# EAGLE design kinks (EAGLE 8.5.2)

## Sheet 1 of 4
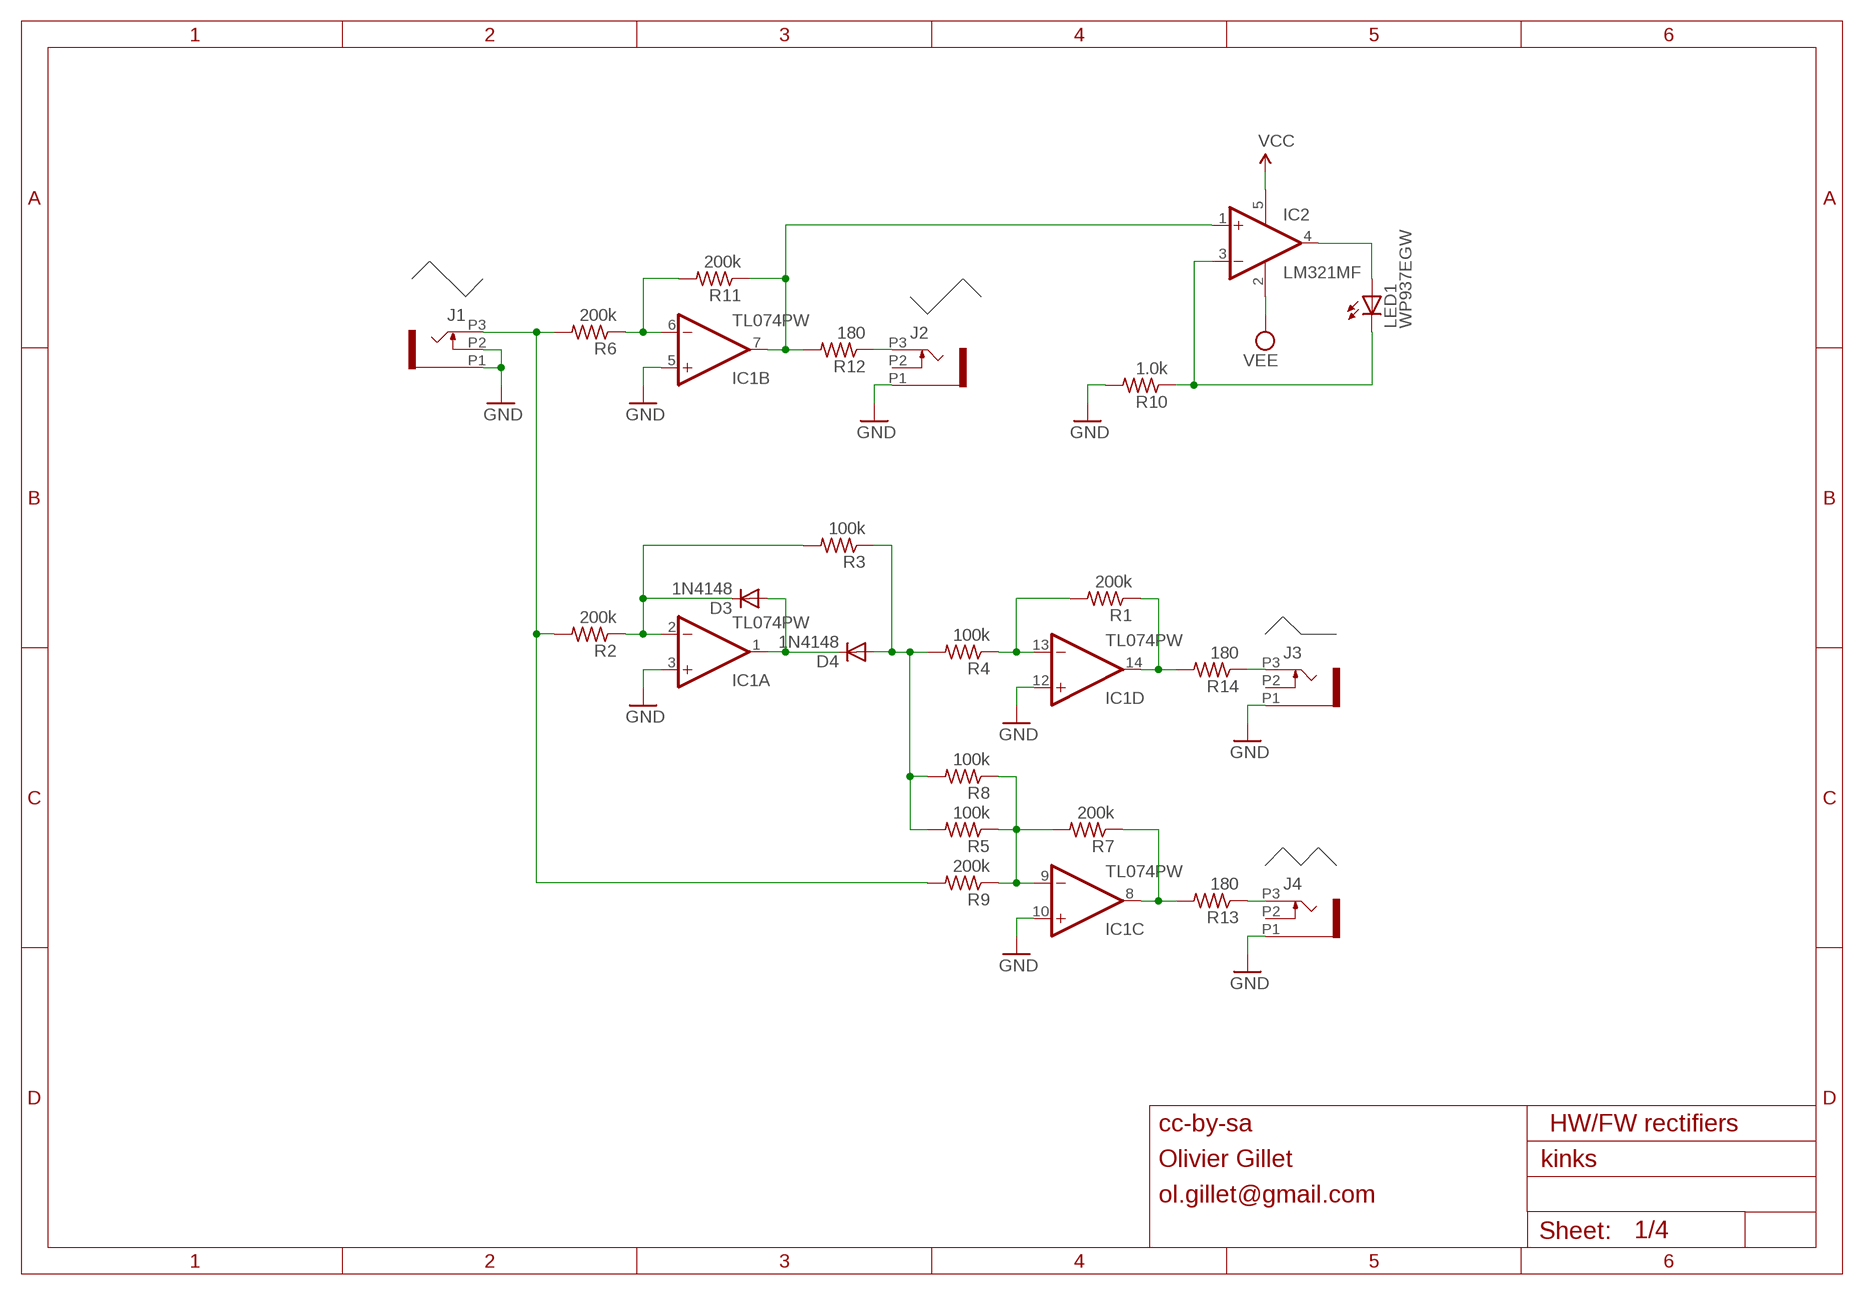
[diagram p0: schematic, sheet 1]

### Parts
D3  1N4148  DIODE-SOD523  [SOD523]
D4  1N4148  DIODE-SOD523  [SOD523]
IC1  TL074PW  [TSSOP14]
IC2  LM321MF  [SOT23-5]
J1  PJ301_THONKICONN6  [WQP_PJ_301M6]
J2  PJ301_THONKICONN6  [WQP_PJ_301M6]
J3  PJ301_THONKICONN6  [WQP_PJ_301M6]
J4  PJ301_THONKICONN6  [WQP_PJ_301M6]
LED1  WP937EGW  LED3MM  [LED3MM]
R1  200k  R-US_R0402  [R0402]
R2  200k  R-US_R0402  [R0402]
R3  100k  R-US_R0402  [R0402]
R4  100k  R-US_R0402  [R0402]
R5  100k  R-US_R0402  [R0402]
R6  200k  R-US_R0402  [R0402]
R7  200k  R-US_R0402  [R0402]
R8  100k  R-US_R0402  [R0402]
R9  200k  R-US_R0402  [R0402]
R10  1.0k  R-US_R0402  [R0402]
R11  200k  R-US_R0402  [R0402]
R12  180  R-US_R0402  [R0402]
R13  180  R-US_R0402  [R0402]
R14  180  R-US_R0402  [R0402]

### Nets
GND: IC1.3(A:+IN) IC1.5(B:+IN) IC1.10(C:+IN) IC1.12(D:+IN) J1.P1 J1.P2 J2.P1 J3.P1 J4.P1 R10.2 ; also sheet 2,3,4
N$9: IC2.3(-IN) LED1.K(C) R10.1
N$11: IC2.4(OUT) LED1.A
N$21: IC1.6(B:-IN) R6.1 R11.2
N$23: IC1.7(B:OUT) IC2.1(+IN) R11.1 R12.2
N$24: J2.P3 R12.1
N$25: D3.C IC1.2(A:-IN) R2.1 R3.2
N$26: D3.A D4.C IC1.1(A:OUT)
N$27: IC1.14(D:OUT) R1.1 R14.2
N$28: IC1.13(D:-IN) R1.2 R4.1
N$32: J3.P3 R14.1
N$33: IC1.9(C:-IN) R5.1 R7.2 R8.1 R9.1
N$34: J4.P3 R13.1
N$35: IC1.8(C:OUT) R7.1 R13.2
N$38: J1.P3 R2.2 R6.2 R9.2
N$39: D4.A R3.1 R4.2 R5.2 R8.2
VCC: IC2.5(V+) ; also sheet 2,3,4
VEE: IC2.2(V-) ; also sheet 2,3,4
Unconnected: J2.P2 J3.P2 J4.P2

### Notes on the sheet
- cc-by-sa | HW/FW rectifiers
- Olivier Gillet
- ol.gillet@gmail.com

## Sheet 2 of 4
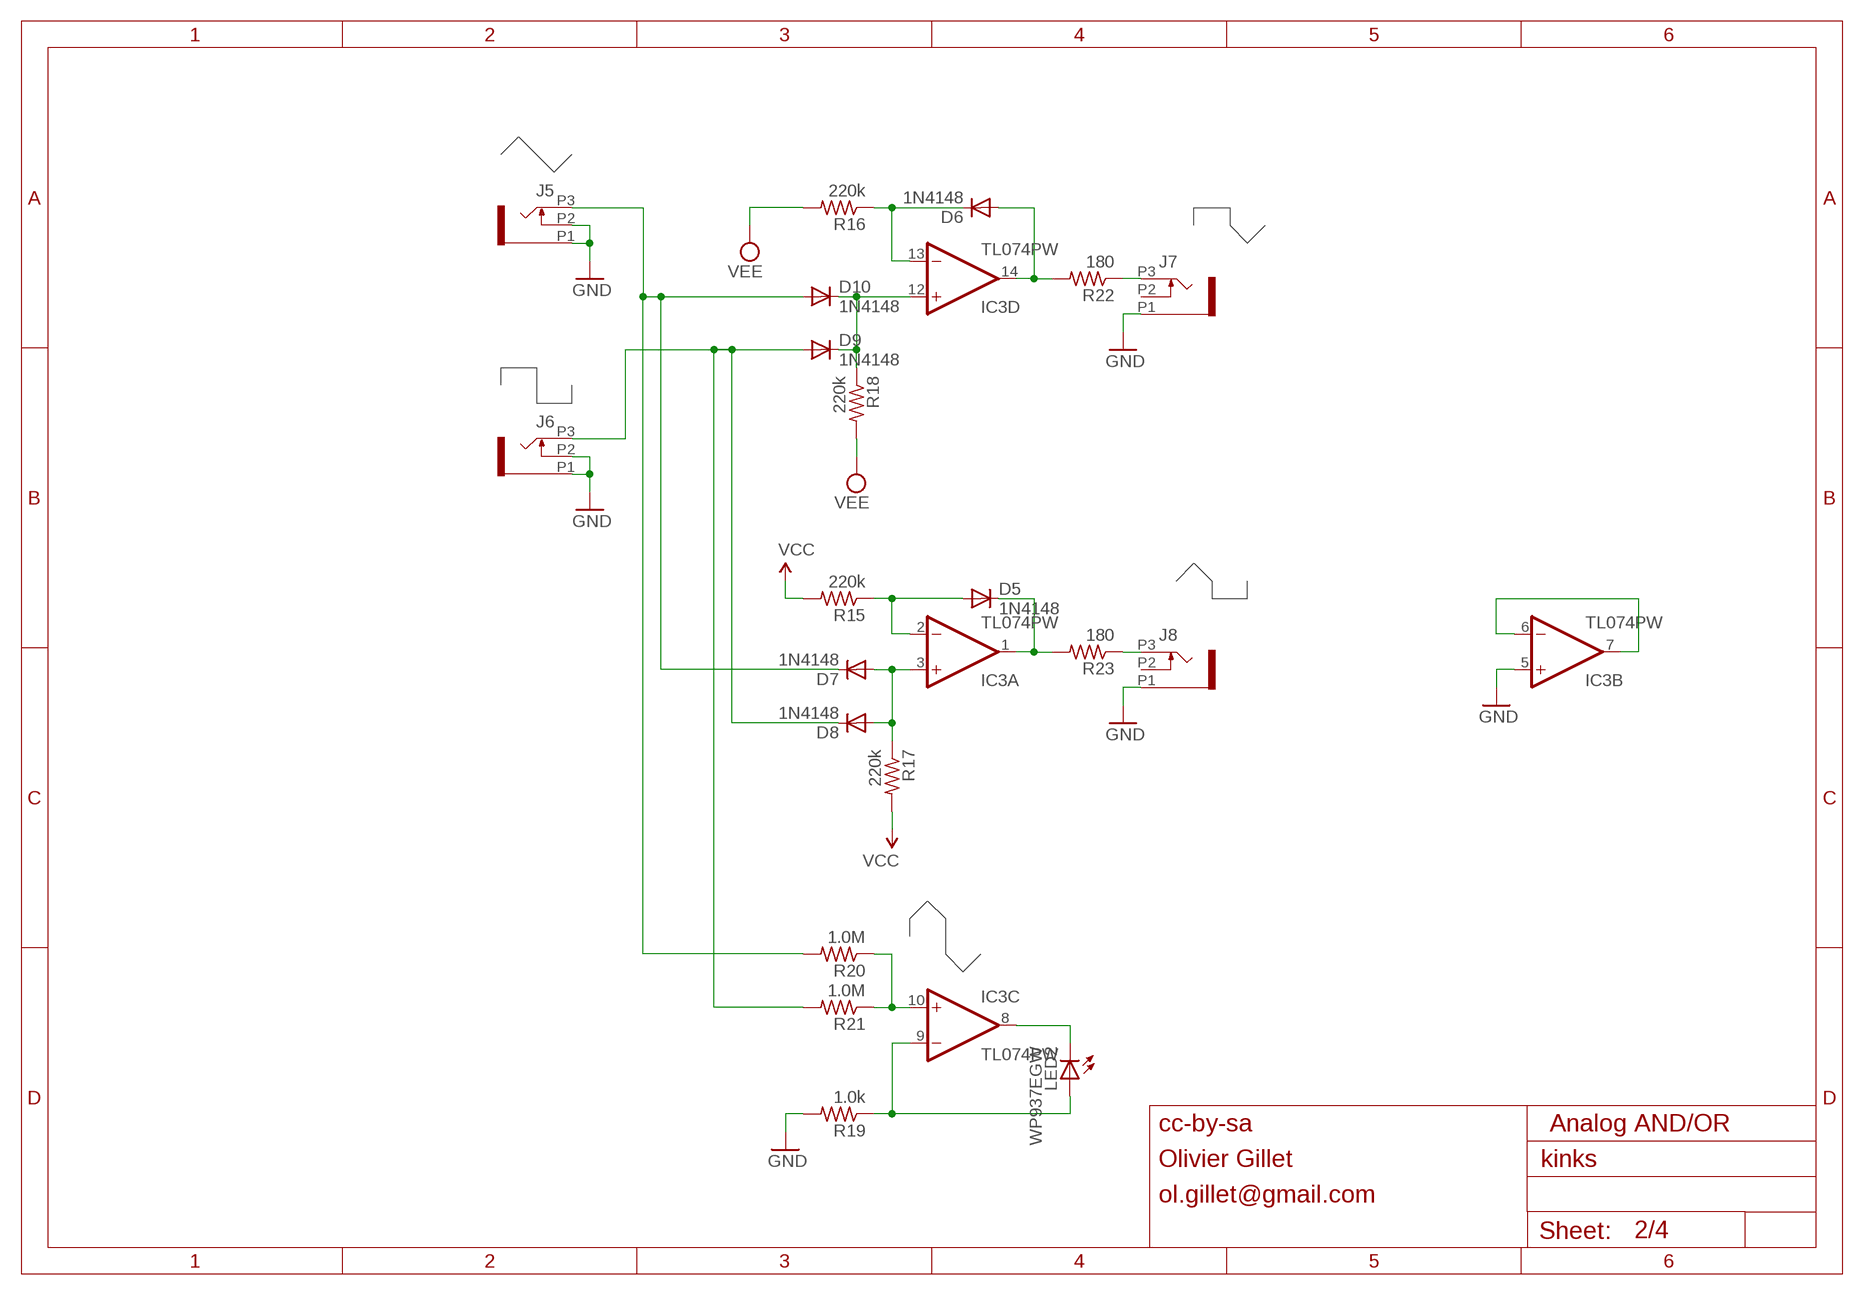
[diagram p1: schematic, sheet 2]

### Parts
D5  1N4148  DIODE-SOD523  [SOD523]
D6  1N4148  DIODE-SOD523  [SOD523]
D7  1N4148  DIODE-SOD523  [SOD523]
D8  1N4148  DIODE-SOD523  [SOD523]
D9  1N4148  DIODE-SOD523  [SOD523]
D10  1N4148  DIODE-SOD523  [SOD523]
IC3  TL074PW  [TSSOP14]
J5  PJ301_THONKICONN6  [WQP_PJ_301M6]
J6  PJ301_THONKICONN6  [WQP_PJ_301M6]
J7  PJ301_THONKICONN6  [WQP_PJ_301M6]
J8  PJ301_THONKICONN6  [WQP_PJ_301M6]
LED2  WP937EGW  LED3MM  [LED3MM]
R15  220k  R-US_R0402  [R0402]
R16  220k  R-US_R0402  [R0402]
R17  220k  R-US_R0402  [R0402]
R18  220k  R-US_R0402  [R0402]
R19  1.0k  R-US_R0402  [R0402]
R20  1.0M  R-US_R0402  [R0402]
R21  1.0M  R-US_R0402  [R0402]
R22  180  R-US_R0402  [R0402]
R23  180  R-US_R0402  [R0402]

### Nets
A: D7.C D10.A J5.P3 R20.2
B: D8.C D9.A J6.P3 R21.2
GND: IC3.5(B:+IN) J5.P1 J5.P2 J6.P1 J6.P2 J7.P1 J8.P1 R19.2 ; also sheet 1,3,4
N$1: D9.C D10.C IC3.12(D:+IN) R18.1
N$2: D6.A IC3.14(D:OUT) R22.2
N$4: D6.C IC3.13(D:-IN) R16.1
N$5: D7.A D8.A IC3.3(A:+IN) R17.1
N$7: IC3.6(B:-IN) IC3.7(B:OUT)
N$10: D5.C IC3.1(A:OUT) R23.2
N$14: IC3.8(C:OUT) LED2.K(C)
N$15: D5.A IC3.2(A:-IN) R15.1
N$17: J8.P3 R23.1
N$18: IC3.10(C:+IN) R20.1 R21.1
N$29: IC3.9(C:-IN) LED2.A R19.1
N$47: J7.P3 R22.1
VCC: R15.2 R17.2 ; also sheet 1,3,4
VEE: R16.2 R18.2 ; also sheet 1,3,4
Unconnected: J7.P2 J8.P2

### Notes on the sheet
- cc-by-sa | Analog AND/OR
- Olivier Gillet
- ol.gillet@gmail.com

## Sheet 3 of 4
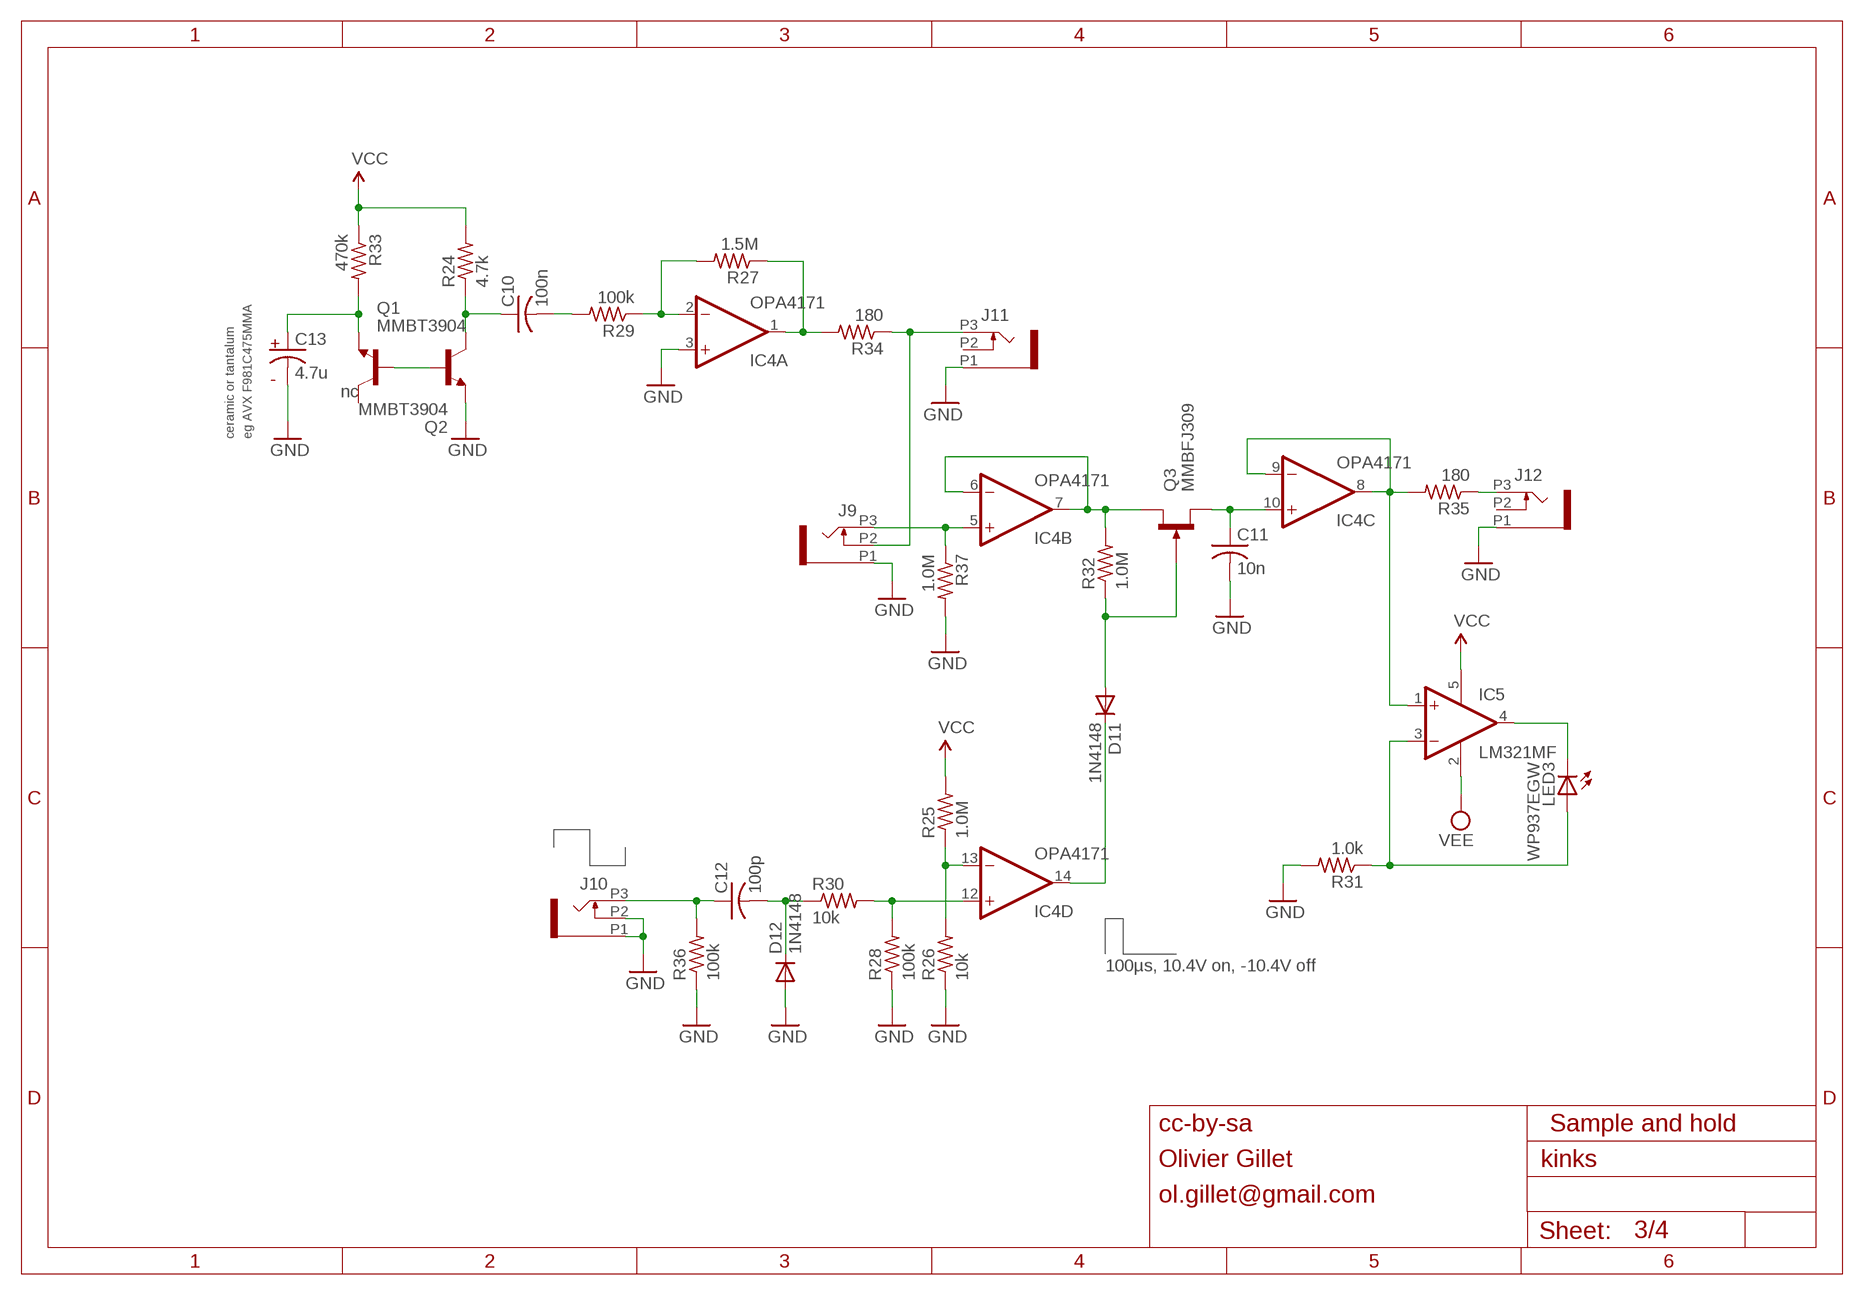
[diagram p2: schematic, sheet 3]

### Parts
C10  100n  C-USC0402  [C0402]
C11  10n  C-USC0603  [C0603]
C12  100p  C-USC0402  [C0402]
C13  4.7u  C-USC0603  [C0603]
D11  1N4148  DIODE-SOD523  [SOD523]
D12  1N4148  DIODE-SOD523  [SOD523]
IC4  OPA4171  TL074PW  [TSSOP14]
IC5  LM321MF  [SOT23-5]
J9  PJ301_THONKICONN6  [WQP_PJ_301M6]
J10  PJ301_THONKICONN6  [WQP_PJ_301M6]
J11  PJ301_THONKICONN6  [WQP_PJ_301M6]
J12  PJ301_THONKICONN6  [WQP_PJ_301M6]
LED3  WP937EGW  LED3MM  [LED3MM]
Q1  MMBT3904  MMBT3904LT1-NPN-SOT23-BEC  [SOT23-BEC]
Q2  MMBT3904  MMBT3904LT1-NPN-SOT23-BEC  [SOT23-BEC]
Q3  MMBFJ309  MMBFJ3  [SOT23]
R24  4.7k  R-US_R0402  [R0402]
R25  1.0M  R-US_R0402  [R0402]
R26  10k  R-US_R0402  [R0402]
R27  1.5M  R-US_R0402  [R0402]
R28  100k  R-US_R0402  [R0402]
R29  100k  R-US_R0402  [R0402]
R30  10k  R-US_R0402  [R0402]
R31  1.0k  R-US_R0402  [R0402]
R32  1.0M  R-US_R0402  [R0402]
R33  470k  R-US_R0402  [R0402]
R34  180  R-US_R0402  [R0402]
R35  180  R-US_R0402  [R0402]
R36  100k  R-US_R0402  [R0402]
R37  1.0M  R-US_R0402  [R0402]

### Nets
GND: C11.2 C13.2 D12.A IC4.3(A:+IN) J9.P1 J10.P1 J10.P2 J11.P1 J12.P1 Q1.E R26.1 R28.1 R31.2 R36.1 R37.2 ; also sheet 1,2,4
N$3: IC4.8(C:OUT) IC4.9(C:-IN) IC5.1(+IN) R35.2
N$8: Q1.B Q2.B
N$12: C13.1 Q2.E R33.2
N$13: C10.2 R29.2
N$16: IC4.2(A:-IN) R27.2 R29.1
N$19: IC5.3(-IN) LED3.A R31.1
N$30: IC5.4(OUT) LED3.K(C)
N$31: C10.1 Q1.C R24.1
N$36: IC4.1(A:OUT) R27.1 R34.2
N$37: J9.P2 J11.P3 R34.1
N$40: IC4.5(B:+IN) J9.P3 R37.1
N$41: IC4.6(B:-IN) IC4.7(B:OUT) Q3.1(D) R32.2
N$42: D11.A Q3.3(G) R32.1
N$43: D11.C IC4.14(D:OUT)
N$45: C11.1 IC4.10(C:+IN) Q3.2(S)
N$46: IC4.12(D:+IN) R28.2 R30.2
N$48: J12.P3 R35.1
N$49: C12.1 J10.P3 R36.2
N$50: IC4.13(D:-IN) R25.1 R26.2
N$51: C12.2 D12.C R30.1
VCC: IC5.5(V+) R24.2 R25.2 R33.1 ; also sheet 1,2,4
VEE: IC5.2(V-) ; also sheet 1,2,4
Unconnected: J11.P2 J12.P2 Q2.C

### Notes on the sheet
- +
- - | nc
- ceramic or tantalum | eg AVX F981C475MMA
- 100µs, 10.4V on, -10.4V off
- cc-by-sa | Sample and hold
- Olivier Gillet
- ol.gillet@gmail.com

## Sheet 4 of 4
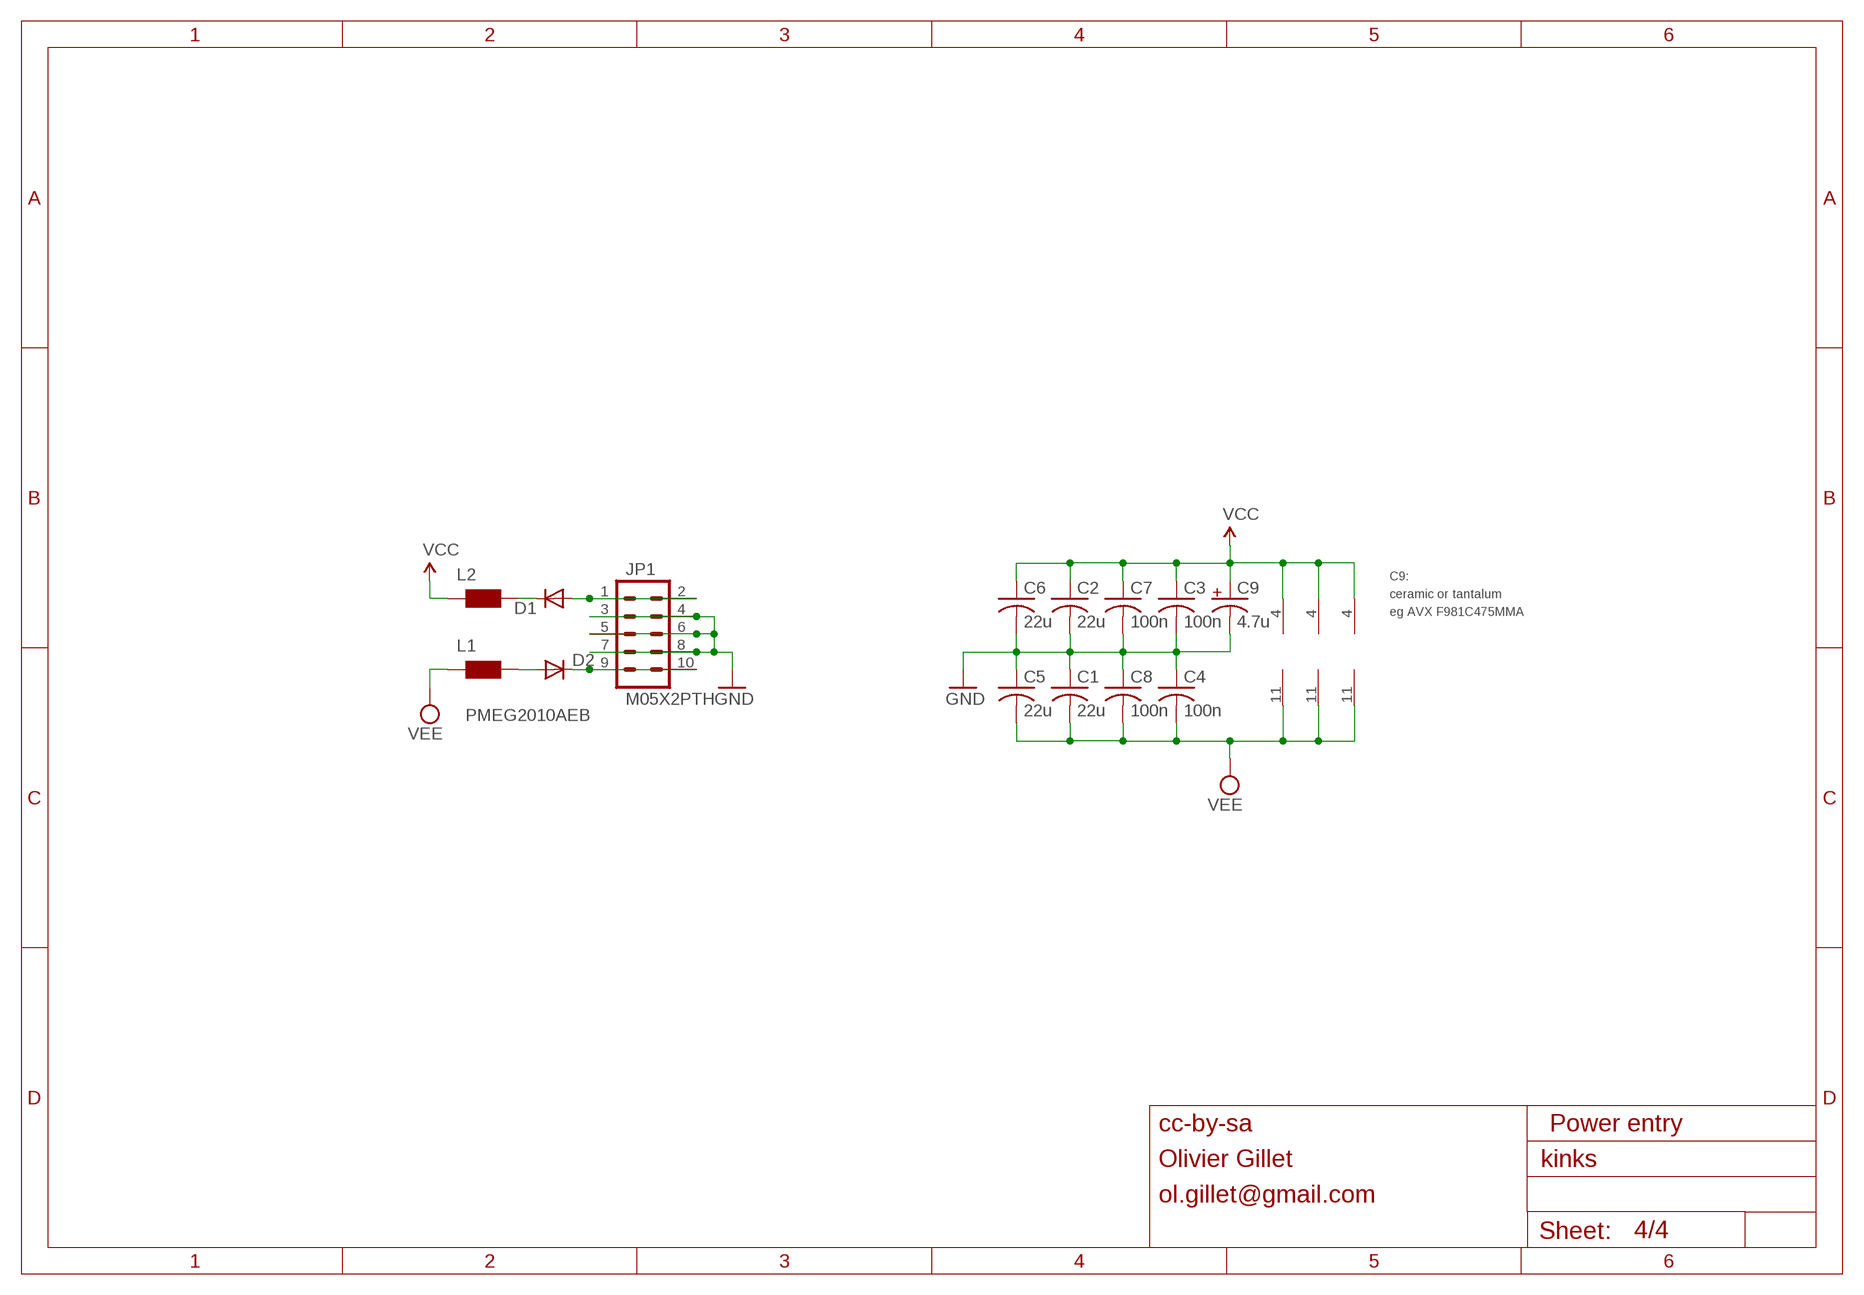
[diagram p3: schematic, sheet 4]

### Parts
C1  22u  C-USC0805  [C0805]
C2  22u  C-USC0805  [C0805]
C3  100n  C-USC0402  [C0402]
C4  100n  C-USC0402  [C0402]
C5  22u  C-USC0805  [C0805]
C6  22u  C-USC0805  [C0805]
C7  100n  C-USC0402  [C0402]
C8  100n  C-USC0402  [C0402]
C9  4.7u  C-USC0603  [C0603]
D1  PMEG2010AEB  DIODE-SOD523  [SOD523]
D2  PMEG2010AEB  DIODE-SOD523  [SOD523]
JP1  M05X2PTH  [AVR_ICSP]
L1  WE-CBF_0603  [0603]
L2  WE-CBF_0603  [0603]

### Nets
GND: C1.1 C2.2 C3.2 C4.1 C5.1 C6.2 C7.2 C8.1 C9.2 JP1.3 JP1.4 JP1.5 JP1.6 JP1.7 JP1.8 ; also sheet 1,2,3
N$6: D1.A JP1.1 JP1.2
N$20: D2.C JP1.9 JP1.10
N$22: D1.C L2.2
N$44: D2.A L1.2
VCC: C2.1 C3.1 C6.1 C7.1 C9.1 IC1.4(P:V+) IC3.4(P:V+) IC4.4(P:V+) L2.1 ; also sheet 1,2,3
VEE: C1.2 C4.2 C5.2 C8.2 IC1.11(P:V-) IC3.11(P:V-) IC4.11(P:V-) L1.1 ; also sheet 1,2,3

### Notes on the sheet
- C9:
- + | ceramic or tantalum
- eg AVX F981C475MMA
- cc-by-sa | Power entry
- Olivier Gillet
- ol.gillet@gmail.com

## Library data of the parts
C1-C13 = rcl:C-US: CAPACITOR, American symbol
D1-D12 = diode:DIODE-: DIODE
IC1 IC3 IC4 = linear:TL074: OP AMP
IC2 IC5 = linear:LM321?*: Low Power Single Op Amp Source: http://cache.national.com/ds/LM/LM321.pdf
J1-J12 = og-pj301:PJ301_THONKICONN
JP1 = og-header:M05X2: Header 5x2 Standard 10-pin dual row 0.1" header. Commonly used with AVR-ISP. Use with Spark Fun Electronics SKU: PRT-00778
L1 L2 = wuerth-elektronik:WE-CBF: SMD EMI Suppression Ferrite Beads - excellent anti-EMI properties - low DCR - impedances till 3000 ohms - rated current up to 6 A
LED1-LED3 = led:LED: LED OSRAM: - CHIPLED LG R971, LG N971, LY N971, LG Q971, LY Q971, LO R971, LY R971 LH N974, LH R974 LS Q976, LO Q976, LY Q976 LO Q996 - Hyper CHIPLED LW Q18S LB Q993, LB Q99A, LB R99A - SideLED LS A670, LO A670, LY A670, LG A670, LP A670 LB A673, LV A673, LT A673, LW A673 LH A674 LY A675 LS A676, LA A676, LO A676, LY A676, LW A676 LS A679, LY A679, LG A679 - Hyper Micro SIDELED® LS Y876, LA Y876, LO Y876, LY Y876 LT Y87S - SmartLED LW L88C, LW L88S LB L89C, LB L89S, LG L890 LS L89K, LO L89K, LY L89K LS L896, LA L896, LO L896, LY L896 - TOPLED LS T670, LO T670, LY T670, LG T670, LP T670 LSG T670, LSP T670, LSY T670, LOP T670, LYG T670 LG T671, LOG T671, LSG T671 LB T673, LV T673, LT T673, LW T673 LH T674 LS T676, LA T676, LO T676, LY T676, LB T676, LH T676, LSB T676, LW T676 LB T67C, LV T67C, LT T67C, LS T67K, LO T67K, LY T67K, LW E67C LS E67B, LA E67B, LO E67B, LY E67B, LB E67C, LV E67C, LT E67C LW T67C LS T679, LY T679, LG T679 LS T770, LO T770, LY T770, LG T770, LP T770 LB T773, LV T773, LT T773, LW T773 LH T774 LS E675, LA E675, LY E675, LS T675 LS T776, LA T776, LO T776, LY T776, LB T776 LHGB T686 LT T68C, LB T68C - Hyper Mini TOPLED® LB M676 - Mini TOPLED Santana® LG M470 LS M47K, LO M47K, LY M47K Source: http://www.osram.convergy.de LUXEON: - LUMILED® LXK2-PW12-R00, LXK2-PW12-S00, LXK2-PW14-U00, LXK2-PW14-V00 LXK2-PM12-R00, LXK2-PM12-S00, LXK2-PM14-U00 LXK2-PE12-Q00, LXK2-PE12-R00, LXK2-PE12-S00, LXK2-PE14-T00, LXK2-PE14-U00 LXK2-PB12-K00, LXK2-PB12-L00, LXK2-PB12-M00, LXK2-PB14-N00, LXK2-PB14-P00, LXK2-PB14-Q00 LXK2-PR12-L00, LXK2-PR12-M00, LXK2-PR14-Q00, LXK2-PR14-R00 LXK2-PD12-Q00, LXK2-PD12-R00, LXK2-PD12-S00 LXK2-PH12-R00, LXK2-PH12-S00 LXK2-PL12-P00, LXK2-PL12-Q00, LXK2-PL12-R00 Source: www.luxeon.com KINGBRIGHT: KA-3528ASYC Source: www.kingbright.com
Q1 Q2 = transistor:*-NPN-: NPN Transistror BF959 corrected 2008.03.06
Q3 = transistor-small-signal:MMBFJ3*: N-Channel RF Amplifier Source: http://www.fairchildsemi.com/pf/J3/J310.html
R1-R37 = rcl:R-US_: RESISTOR, American symbol

## Board
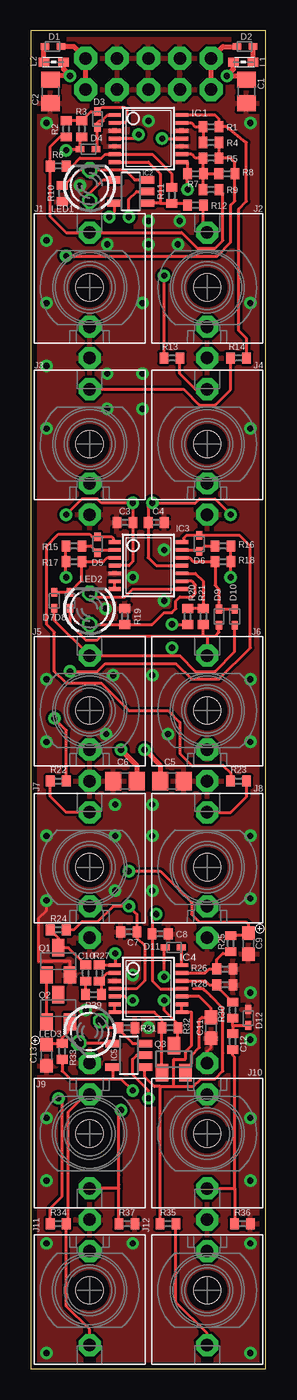
[diagram p4: board, top side]
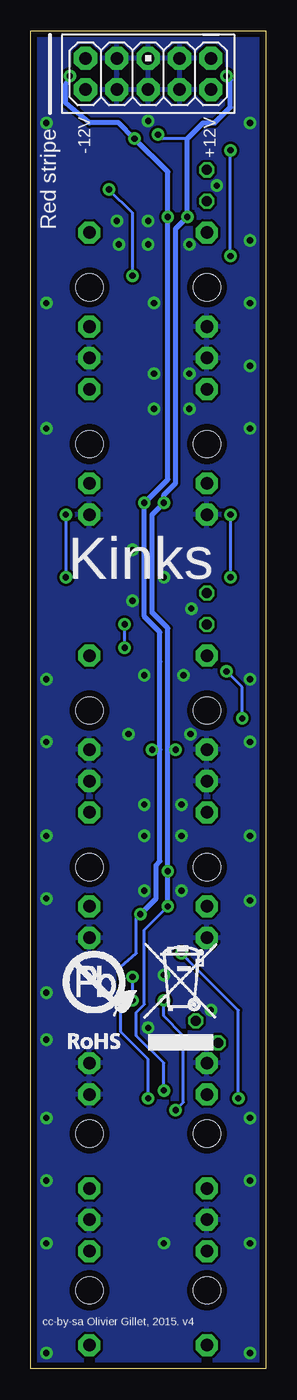
[diagram p5: board, bottom side, seen from below]

Size 19.03 x 108.43 mm. Coordinates in mm from the lower left corner, seen from the top.
Outline: 0,0 19.03,0 19.03,108.43 0,108.43 0,0
Copper layers (1*16): Top 0.035mm / dielectric 1.5mm / Bottom 0.035mm
Design rules "PCBCart-Standard *": minimum track width 8mil, minimum drill 0.4mm, track to track 8mil, track to pad 8mil, pad to pad 8mil, via to via 8mil, smd to smd 8mil, copper to edge 20mil, drill to drill 8mil, minimum pad ring 8mil, minimum via ring 10mil, stop-mask expansion 3mil, vias tented up to drill 25mil, thermal gap 8mil

### Footprints (pad centres in the part's own frame; a part is rotated, then mirrored left to right if it is on the bottom)
C0805 = smd 1.3 x 1.5: 1 -0.95,0; 2 0.95,0
C0402 = smd 0.7 x 0.9: 1 -0.65,0; 2 0.65,0
C0603 = smd 1.1 x 1: 1 -0.85,0; 2 0.85,0
SOD523 = smd 0.7 x 0.5: A 0.7,0; C -0.6,0
TSSOP14 = smd 0.305 x 0.991: 1 -1.905,-2.718; 2 -1.27,-2.718; 3 -0.635,-2.718; 4 0,-2.718; 5 0.635,-2.718; 6 1.27,-2.718; 7 1.905,-2.718; 8 1.905,2.718; 9 1.27,2.718; 10 0.635,2.718; 11 0,2.718; 12 -0.635,2.718; 13 -1.27,2.718; 14 -1.905,2.718
SOT23-5 = smd 0.6 x 1.2: 1 -0.95,-1.306; 2 0,-1.306; 3 0.95,-1.306; 4 0.95,1.306; 5 -0.95,1.306
WQP_PJ_301M6 = drill 1.016 pad 1.778 octagon: P1 0,-5.715; P2 0,-3.175; P3 0,4.445 | hole 2.2: 0,0
AVR_ICSP = drill 1.016 pad 1.88 octagon: 1 -1.27,5.08; 2 1.27,5.08; 3 -1.27,2.54; 4 1.27,2.54; 5 -1.27,0; 6 1.27,0; 7 -1.27,-2.54; 8 1.27,-2.54; 9 -1.27,-5.08; 10 1.27,-5.08
0603 = smd 0.85 x 0.7: 1 -0.9,0; 2 0.7,0
LED3MM = drill 0.813 octagon: A -1.27,0; K 1.27,0
SOT23-BEC = smd 1 x 1.4: B -0.95,-1.1; C 0,1.1; E 0.95,-1.1
SOT23 = smd 1 x 1.4: 1 -0.95,-1.1; 2 0.95,-1.1; 3 0,1.1
R0402 = smd 0.7 x 0.9: 1 -0.65,0; 2 0.65,0

### Placement (x,y rotation side)
C1  17.46,103.51 90 top
C2  1.59,103.5 270 top
C3  7.62,68.58 180 top
C4  10.16,68.58 180 top
C5  11.43,47.63 180 top
C6  7.62,47.63 180 top
C7  7.94,35.4 180 top
C8  10.48,35.24 180 top
C9  17.62,34.45 270 top
C10  4.45,32.07 270 top
C11  14.61,27.62 270 top
C12  16.35,26.51 90 top
C13  1.27,25.4 270 top
D1  1.75,107.16 0 top
D2  17.3,107.16 0 top
D3  5.4,101.28 270 top
D4  4.68,98.82 180 top
D5  5.4,66.83 270 top
D6  13.65,66.83 90 top
D7  1.91,62.23 90 top
D8  3.17,62.23 90 top
D9  15.24,60.96 270 top
D10  16.51,60.96 270 top
D11  11.59,34.13 180 top
D12  17.62,28.42 90 top
IC1  9.53,99.69 270 top
IC2  8.1,95.41 90 top
IC3  9.53,65.09 270 top
IC4  9.53,30.8 270 top
IC5  7.94,25.4 90 top
J1  4.76,87.63 0 top
J2  14.29,87.63 0 top
J3  4.76,74.93 0 top
J4  14.29,74.93 0 top
J5  4.76,53.34 0 top
J6  14.29,53.34 0 top
J7  4.76,40.64 0 top
J8  14.29,40.64 0 top
J9  4.76,19.05 180 top
J10  14.29,19.05 180 top
J11  4.76,6.35 180 top
J12  14.29,6.35 180 top
JP1  9.53,104.93 270 bottom
L1  17.3,105.89 0 top
L2  1.75,105.89 180 top
LED1  4.76,95.89 90 top
LED2  4.76,61.59 90 top
LED3  4.76,27.3 225 top
Q1  2.22,33.02 0 top
Q2  2.22,29.21 0 top
Q3  11.59,25.08 0 top
R1  14.61,100.65 180 top
R2  2.86,100.49 270 top
R3  4.13,100.49 90 top
R4  14.61,99.38 0 top
R5  14.61,98.11 0 top
R6  2.22,97.47 180 top
R7  13.34,96.84 0 top
R8  15.88,96.84 0 top
R9  14.61,95.57 0 top
R10  2.54,95.25 270 top
R11  11.43,95.09 90 top
R12  13.34,94.3 180 top
R13  11.43,81.92 180 top
R14  16.83,81.92 0 top
R15  3.49,66.67 180 top
R16  15.56,66.67 0 top
R17  3.49,65.41 180 top
R18  15.56,65.41 0 top
R19  7.62,60.96 90 top
R20  12.7,60.96 270 top
R21  13.97,60.96 270 top
R22  2.22,47.62 0 top
R23  16.83,47.62 180 top
R24  2.22,35.56 0 top
R25  16.19,34.45 90 top
R26  15.72,32.38 180 top
R27  5.56,32.07 270 top
R28  15.72,31.11 180 top
R29  5.08,30.32 180 top
R30  16.35,29.05 90 top
R31  7.78,27.62 0 top
R32  11.27,27.62 180 top
R33  2.54,25.72 90 top
R34  2.22,11.75 180 top
R35  11.11,11.75 180 top
R36  17.14,11.75 180 top
R37  7.78,11.75 0 top
U$2  [ROHS]  17.3,25.24 0 bottom

### Tracks (layer width: path | path; a pad name or v marks a point on that pad's centre or on a via)
A  (via drill 0.5)
  Top 0.254: 11.43,57.78 J5.P3 1.91,60.64 D7.C | 11.43,57.78 12.06,57.78 13.34,56.52 14.92,56.52 16.51,58.1 D10.A | R20.2 12.69,60.33 v11.43,60.33 | 11.43,57.78 v11.43,58.42
  Bottom 0.254: v11.43,58.42 v11.43,60.33
B
  Top 0.254: 13.97,59.37 5.71,59.37 5.4,59.05 4.45,59.05 3.17,60.33 D8.C | 13.97,59.37 14.29,59.37 | 14.29,59.37 14.92,59.37 15.24,59.69 D9.A | 13.97,59.37 R21.2 | 14.29,59.37 J6.P3
GND  (via drill 0.5)
  Top 0.254: J10.P1 14.29,25.72 14.61,26.04 C11.2 | Q1.E 3.17,33.02 0.64,33.02 0.64,36.51 1.27,37.15 v1.27,37.94
  other vias: 8.26,64.14 10.79,66.36 3.97,95.89 9.53,101.12 9.05,77.79 6.19,80.64 1.27,55.88 9.53,91.12 17.78,30.48 8.26,10.16 6.83,43.18 9.84,45.72 1.27,1.27 17.78,1.27 17.78,10.16 1.27,10.16 17.78,15.24 1.27,15.24 1.27,20.32 17.78,20.32 17.78,26.67 17.78,38.1 17.78,43.18 1.27,43.18 1.27,76.2 1.27,100.97 17.78,100.97 9.84,43.18 8.25,31.91 6.19,91.12 9.05,80.64 11.91,91.12 17.78,55.88 6.19,77.79 1.27,50.8 17.78,50.8 6.1,51.43 11.11,51.43 17.78,76.2 1.27,81.28 1.27,86.36 1.27,91.44 17.78,86.36 9.05,86.36 9.52,27.62 6.83,38.73 9.84,38.73 4.44,29.05 9.84,56.2 6.83,45.72 9.53,93.03 12.06,93.03 6.03,61.59 10.79,62.23 6.67,56.2
  pour Bottom: 0,108.43 0,0 19.05,0 19.05,108.43
  pour Top: 0,108.43 0,0 19.05,0 19.05,108.43
N$1
  Top 0.254: IC3.12 12.86,65.72 13.18,65.41 R18.1 14.92,65.39 14.92,63.5 15.24,63.18 D9.C D10.C
N$2  (via drill 0.5)
  Top 0.254: D6.A 13.72,67.63 | v3.17,56.52 5.4,56.52 6.03,57.15 11.75,57.15 13.02,55.88 15.24,55.88 17.78,58.42 17.78,66.67 16.92,67.53 D6.A | v1.91,52.7 2.87,51.74 R22.2 | IC3.14 12.38,67.13 12.38,67.31 12.61,67.53 D6.A
  Bottom 0.254: v3.17,56.52 1.91,55.24 v1.91,52.7
N$3
  Top 0.254: IC4.9 | IC4.8 | IC4.8 12.22,28.87 | IC4.8 | 10.48,22.86 11.59,22.86 | 11.59,22.86 13.18,22.86 13.81,23.5 14.92,23.5 15.56,24.13 15.56,25.56 15.56,29.21 14.61,30.16 14.29,30.48 13.97,30.8 13.34,30.8 13.18,30.8 | R35.2 10.48,11.76 10.48,22.86 | 11.59,22.86 11.59,25.08 12.54,25.08 12.54,25.72 13.02,26.19 13.02,28.89 IC4.8 | IC4.8 IC4.9 | IC5.1 9.21,24.25 9.21,23.65 10,22.86 10.48,22.86
N$4
  Top 0.254: R16.1 14.09,66.67 D6.C 13.53,66.36 IC3.13
N$5
  Top 0.254: IC3.3 6.19,65.72 5.87,65.41 R17.1 4.14,63.9 D8.A D7.A
N$6
  Top 0.406: JP1.2 JP1.1 3.49,107.16 D1.A
N$7
  Top 0.254: IC3.7 IC3.6
N$8
  Top 0.254: Q2.B Q1.B
N$9
  Top 0.254: IC2.3 8.42,96.36 7.62,97.16 LED1.K 3.97,97.16 2.71,95.9 R10.1
N$10
  Top 0.254: R23.2 16.18,48.27 15.56,48.9 13.02,48.9 12.06,49.85 12.06,52.39 11.11,53.34 7.94,53.34 5.71,55.56 2.86,55.56 1.91,56.52 1.91,59.69 1.27,60.33 1.27,66.67 2.22,67.63 4.76,67.63 4.96,67.43 D5.C | D5.C 5.43,67.59 | IC3.1 6.67,67.13 6.67,67.31 6.54,67.43 D5.C
N$11
  Top 0.254: LED1.A 4.76,95.25 5.87,96.36 IC2.4
N$12
  Top 0.254: C13.1 1.39,26.37 R33.2 2.54,26.83 3.02,27.3 3.02,27.95 Q2.E
N$13
  Top 0.254: R29.2 4.45,30.34 C10.2
N$14
  Top 0.254: LED2.K 5.08,62.55 7.62,62.55 8.26,63.18 IC3.8
N$15
  Top 0.254: R15.1 4.86,66.67 D5.A 5.62,66.36 IC3.2
N$16
  Top 0.254: IC4.2 6.19,32.07 5.56,31.43 R27.2 5.73,31.24 R29.1
N$17
  Top 0.254: J8.P3 16.19,45.09 17.48,46.37 R23.1
N$18
  Top 0.254: IC3.10 13.34,64.45 13.97,63.82 R21.1 R20.1
N$19
  Top 0.254: LED3.A 6.24,27.62 R31.1 7.13,27.48 8.26,26.35 IC5.3
N$20
  Top 0.406: JP1.10 JP1.9 15.56,107.16 D2.C
N$21
  Top 0.254: 2.86,97.47 R6.1 3.33,97.47 3.97,98.11 5.71,98.11 6.03,98.42 IC1.6 9.84,98.42 11.43,96.84 R11.2
N$22
  Top 0.406: D1.C 1.05,106.9 L2.2
N$23
  Top 0.254: IC1.7 9.53,97.79 10.48,96.84 10.48,94.46 | IC2.1 10.48,94.46 | 10.48,94.46 11.41,94.46 R11.1 12.54,94.44 R12.2
N$24
  Top 0.254: J2.P3 13.98,92.38 R12.1
N$25
  Top 0.254: IC1.2 7.62,100.97 7.78,101.12 7.78,102.08 7.62,102.23 5.75,102.23 D3.C 4.87,101.88 R3.2 R2.1
N$26
  Top 0.254: D4.C 5.24,98.87 5.4,99.03 D3.A 5.4,100.97 5.56,101.12 5.87,101.12 5.87,101.28 6.19,101.6 IC1.1
N$27
  Top 0.254: IC1.14 14.92,101.6 15.26,101.27 R1.1 15.88,100.65 17.46,99.38 17.46,94.61 16.83,93.98 16.83,84.14 17.48,83.49 R14.2
N$28
  Top 0.254: IC1.13 13.02,100.97 13.34,100.65 R1.2 R4.1
N$29
  Top 0.254: IC3.9 13.02,63.82 13.34,63.5 13.34,62.87 13.02,62.55 12.06,62.55 11.75,62.23 11.75,61.59 11.43,61.28 10.79,61.28 9.83,60.31 R19.1 7.61,60.33 LED2.A
N$30
  Top 0.254: IC5.4 6.57,26.41 LED3.K
N$31
  Top 0.254: R24.1 2.22,34.91 Q1.C | Q1.C 2.55,34.12 | C10.1 3.04,34.12 Q1.C
N$32
  Top 0.254: R14.1 16.18,79.36 14.92,78.11 13.65,78.11 12.38,79.38 J3.P3
N$33
  Top 0.254: IC1.9 13.02,98.42 13.34,98.11 R5.1 | R5.1 | R9.1 13.98,95.6 R7.2 | R7.2 13.96,96.87 R5.1 | R7.2 R8.1
N$34
  Top 0.254: J4.P3 13.34,79.38 12.08,80.63 R13.1
N$35  (via drill 0.5)
  Top 0.254: v12.7,95.57 12.69,95.87 R7.1 12.7,96.85 12.7,97.79 IC1.8 | R13.2 10.79,81.93 v10.79,88.58
  Bottom 0.254: v12.7,95.57 10.79,93.66 v10.79,88.58
N$36  (via drill 0.5)
  Top 0.254: R34.2 1.57,13 2.54,13.97 2.54,21.59 v2.22,21.91 | IC4.1 6.83,32.72 v6.83,33.66 | IC4.1 | R27.1 5.57,32.7 IC4.1
  Bottom 0.254: v6.83,33.66 6.35,33.18 2.22,29.05 v2.22,21.91
N$37
  Top 0.254: J11.P3 4.76,3.17 2.87,5.07 R34.1 3.02,11.8 3.02,20.8 4.45,22.23 J9.P2
N$38
  Top 0.254: R2.2 2.37,99.84 1.57,99.05 R6.2 1.57,93.36 2.86,92.08 J1.P3 12.22,92.08 13.49,90.81 14.92,90.81 15.56,91.44 15.56,95.23 15.24,95.55 R9.2
N$39  (via drill 0.5)
  Top 0.254: v2.86,98.74 2.94,98.82 D4.A 3.98,99.69 R3.1 | R4.2 R5.2 16.19,98.11 16.52,97.78 R8.2 16.52,94.63 16.19,94.3 16.19,91.28 15.08,90.17 v2.86,90.17
  Bottom 0.254: v2.86,90.17 v2.86,98.74
N$40  (via drill 0.5)
  Top 0.254: IC4.5 7.62,30.16 7.94,29.84 v8.26,29.84 | R37.1 7.13,14.61 | 7.13,14.61 7.13,14.92 7.13,15.7 7.13,20.78 v7.3,20.95 | 7.13,14.61 J9.P3
  Bottom 0.254: v8.26,29.84 8.26,28.57 6.67,26.99 6.67,21.59 v7.3,20.95
N$41
  Top 0.254: IC4.7 IC4.6 | IC4.7 | Q3.1 10.62,24 R32.2 10.64,27.64 10.64,28.26 10,28.89 7.94,28.89 | 7.94,28.89 | 7.94,28.89 IC4.7
N$42  (via drill 0.5)
  Top 0.254: v10.79,29.84 10.79,29.05 11.92,27.93 R32.1 11.92,26.52 Q3.3 11.6,26.2 | D11.A 10.79,34.04 v10.79,31.75
  Bottom 0.254: v10.79,29.84 v10.79,31.75
N$43
  Top 0.254: IC4.14 12.24,34.08 D11.C
N$44
  Top 0.406: L1.2 D2.A
N$45
  Top 0.254: IC4.10 13.65,30.16 14.61,29.21 C11.1 13.87,28.47 13.65,28.26 13.65,26.04 13.02,25.4 13.02,24.77 12.7,24.45 12.7,24.14 Q3.2
N$46
  Top 0.254: IC4.12 14.13,31.43 14.45,31.11 R28.2 | R28.2 | R30.2 15.07,30.99 R28.2
N$47
  Top 0.254: J7.P3 2.86,45.09 1.57,46.37 R22.1
N$48
  Top 0.254: J12.P3 14.29,2.86 11.75,5.4 11.75,11.73 R35.1
N$49
  Top 0.254: J10.P3 16.51,14.61 | R36.2 16.51,11.76 16.51,14.61 | 16.51,14.61 16.51,25.24 16.35,25.4 C12.1
N$50
  Top 0.254: R25.1 16.19,33.6 16.14,33.66 15.56,33.66 15.07,33.16 R26.2 14.45,32.38 14.13,32.07 IC4.13
N$51
  Top 0.254: 16.35,27.78 R30.1 | D12.C 17.59,27.78 16.35,27.78 | 16.35,27.78 | 16.35,27.78 C12.2
VCC  (via drill 0.5)
  Top 0.254: IC3.4 7.94,65.09 8.27,65.42 C3.1 8.26,68.59 v8.26,70.17 5.71,70.17 5.4,70.48 4.13,70.48 v2.86,69.22 | v8.73,100.01 8.41,99.69 IC1.4 | 16.19,35.3 R25.2 17.42,35.1 C9.1 17.62,36.04 17.46,36.2 13.65,36.2 13.02,36.83 13.02,37.78 10.48,40.32 v7.94,40.32 | v6.35,93.34 6.79,93.78 IC2.5 | IC4.4 | IC4.4 8.57,30.8 9.21,31.43 9.21,34.29 8.57,34.92 8.57,35.23 C7.1 8.59,36.81 v7.94,37.47 | IC5.5 6.67,24.41 6.67,23.5 | 6.67,23.5 3.17,23.5 2.54,24.13 R33.1 | 6.67,23.5 7.3,23.5 v8.26,22.54 | v7.94,37.47 | R24.2 | R24.2 3.49,35.56 4.13,36.2 5.4,36.2 6.67,37.47 v7.94,37.47 | C6.1 | R15.2 R17.2 2.84,64.15 v2.86,64.14
  Top 0.406: C2.1 1.91,104.78 v3.17,104.78 2.65,105.3 L2.1 | C6.1 8.57,48.9 v7.3,50.16
  Bottom 0.254: 6.35,99.69 8.41,99.69 v8.73,100.01 | v7.94,37.47 9.84,35.56 9.84,29.53 10.48,28.89 10.48,26.99 8.26,24.77 v8.26,22.54 | v2.86,69.22 v2.86,64.14
  Bottom 0.406: v7.94,40.32 7.94,50.16 | 7.94,50.16 7.94,60.01 9.21,61.28 9.21,69.22 v8.26,70.17 8.26,70.8 7.3,71.75 7.3,92.39 v6.35,93.34 6.35,99.69 5.08,100.97 4.13,100.97 2.86,102.23 2.86,104.46 v3.17,104.78 | v7.94,37.47 | v7.94,40.32 | v7.94,37.47 v7.94,40.32 | 7.94,50.16 v7.3,50.16
VEE  (via drill 0.5)
  Top 0.254: IC4.11 | IC4.11 10.48,30.8 9.84,31.43 9.84,35.23 C8.2 9.83,36.5 v10.16,36.83 | v10.64,99.69 IC1.11 | v7.94,93.34 7.94,94.77 8.57,95.41 IC2.2 | IC3.11 10.16,65.09 9.51,65.74 C4.2 9.51,69.83 v9.84,70.17 13.34,70.17 13.65,70.48 14.92,70.48 v16.19,69.22 | IC5.2 8.57,25.4 8.26,25.08 8.26,23.81 9.53,22.54 v9.53,21.91 | C5.2 | R16.2 R18.2 16.19,65.39 v16.19,64.14
  Top 0.406: C1.2 17.14,104.78 v15.88,104.78 16.4,105.3 L1.1 | C5.2 10.48,48.9 v9.21,50.16
  Bottom 0.254: v10.16,36.83 10.48,36.51 10.48,33.66 11.75,32.54 11.75,27.3 9.53,25.08 v9.53,21.91 | v16.19,69.22 v16.19,64.14
  Bottom 0.406: 8.57,50.16 8.57,41.12 8.89,40.8 8.89,38.1 v10.16,36.83 | 8.57,50.16 8.57,57.31 8.57,59.69 9.53,60.64 9.84,60.96 v9.84,70.17 7.94,72.07 v7.94,93.34 7.94,97 v10.64,99.69 11.91,100.97 14.29,100.97 16.19,102.55 16.19,104.14 15.88,104.46 v15.88,104.78 | 8.57,50.16 v9.21,50.16

### Text on the board
bPlace: Red stripe
bNames: +12V | -12V | Kinks | cc-by-sa Olivier Gillet, 2015. v4